# Altium schematic sheet Power.SchDoc: F4 Flight Controller
size 500 x 299 mm; Engineer: İlker Keser; SheetNumber: 2; SheetTotal: 6
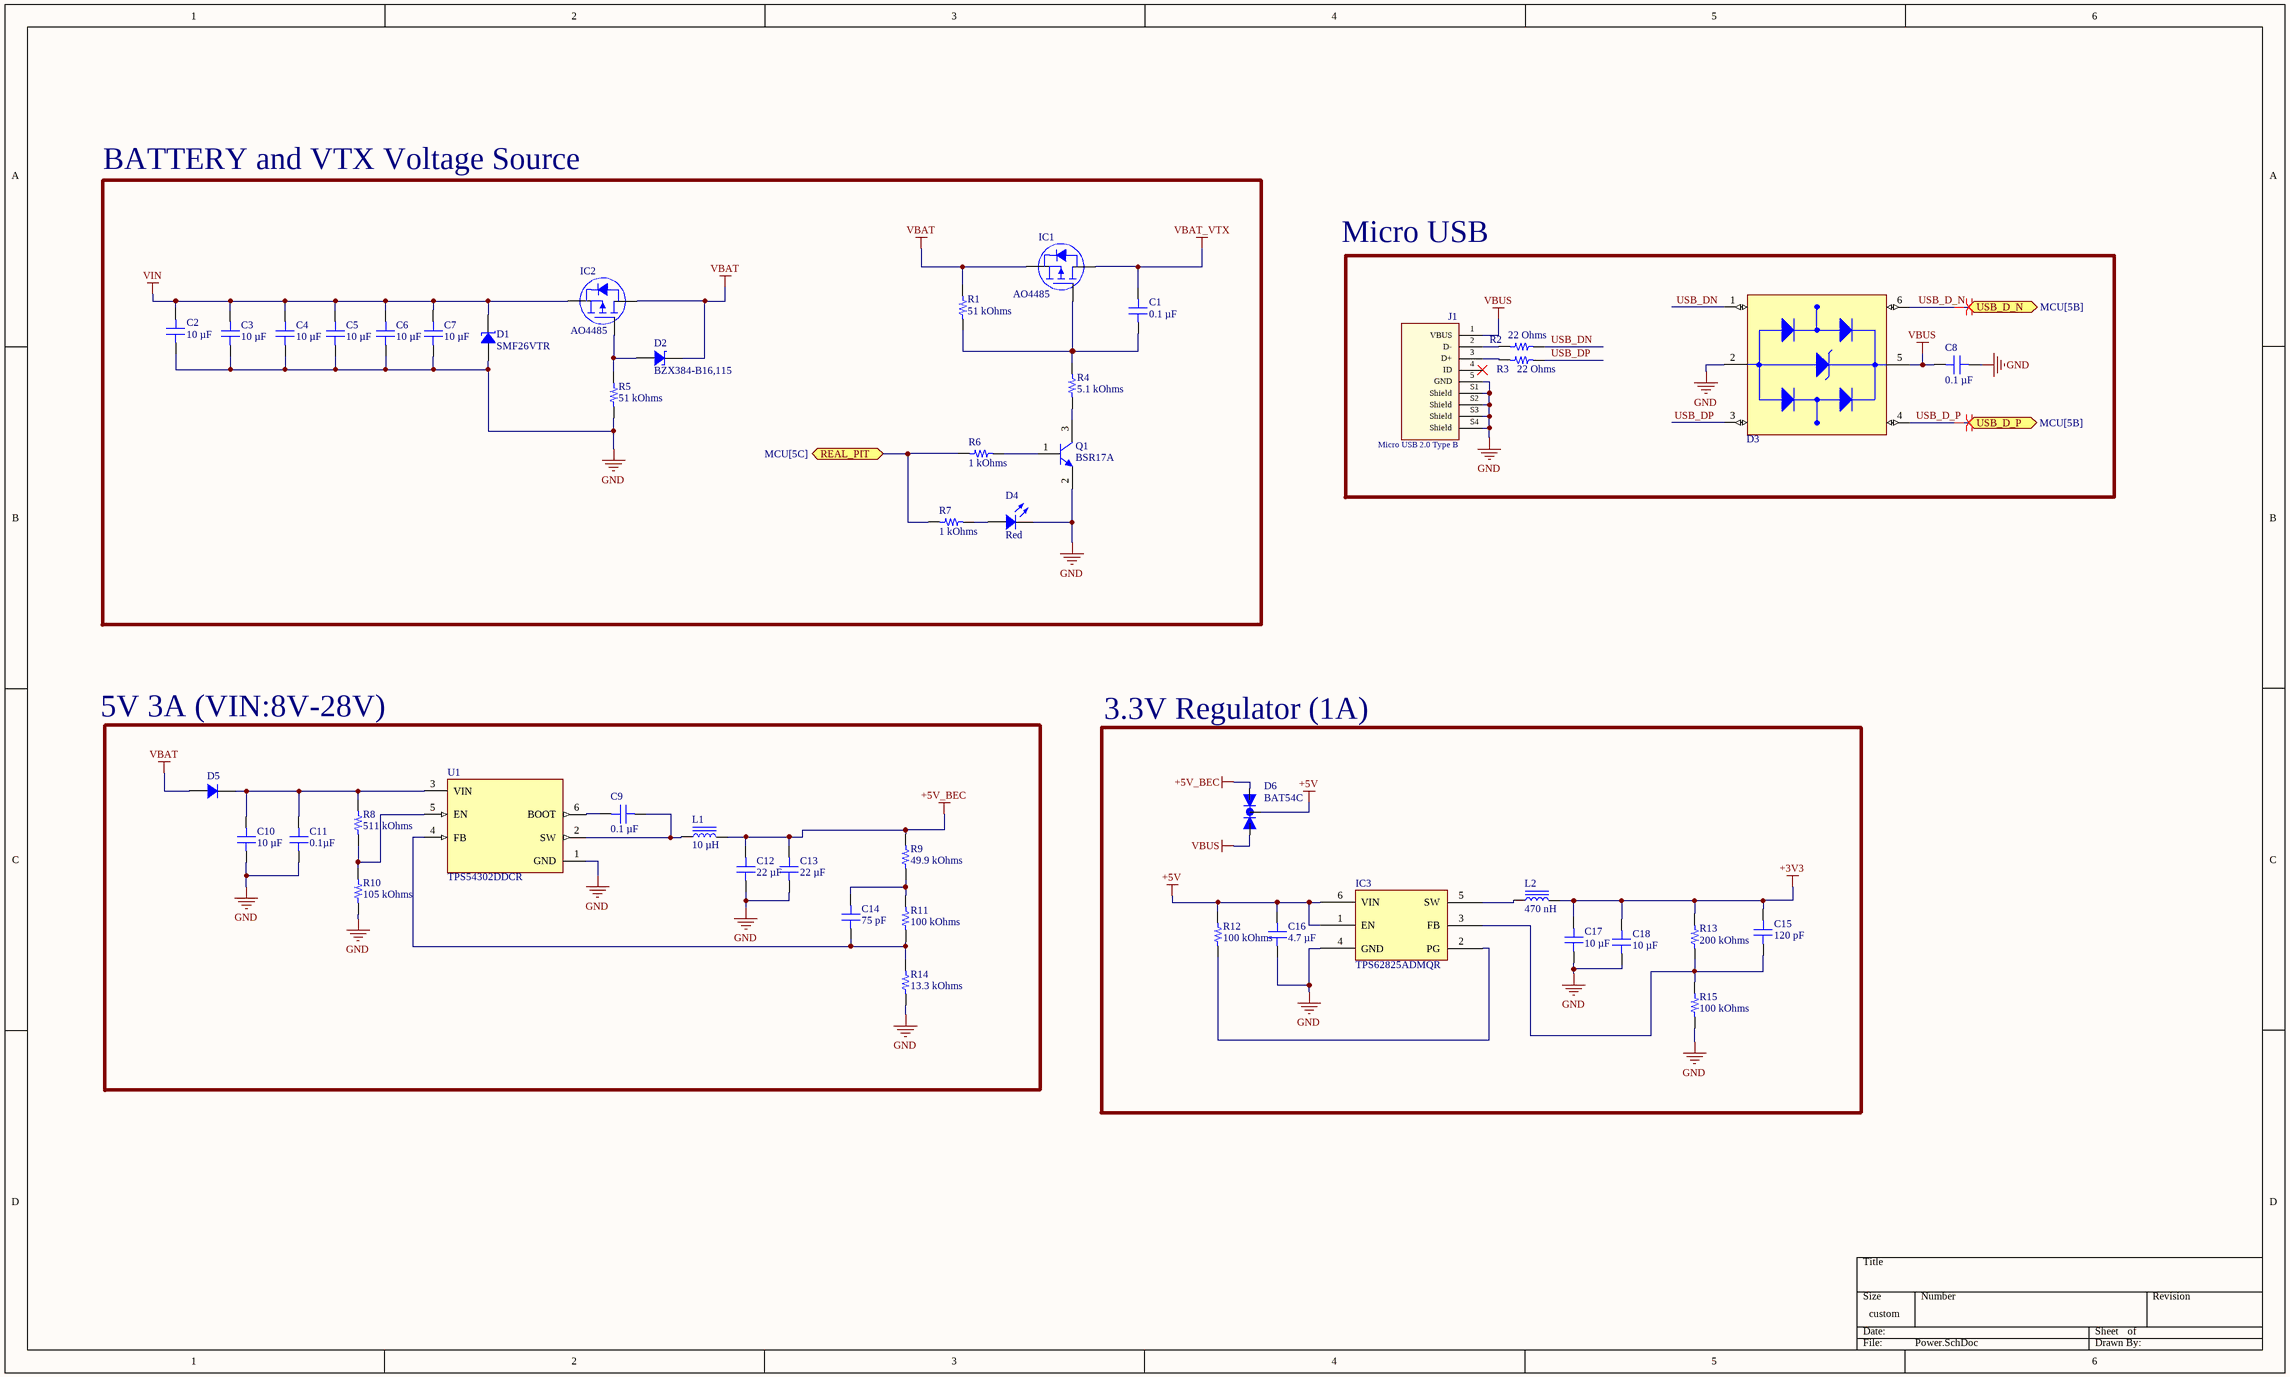
[diagram p0: Power.SchDoc]

## Parts
C1  0.1 µF  [CAP 0603_1608]
C2  10 µF  [MURATA CAP GRM31C 1206_3216]
C3  10 µF  [MURATA CAP GRM31C 1206_3216]
C4  10 µF  [MURATA CAP GRM31C 1206_3216]
C5  10 µF  [MURATA CAP GRM31C 1206_3216]
C6  10 µF  [MURATA CAP GRM31C 1206_3216]
C7  10 µF  [MURATA CAP GRM31C 1206_3216]
C8  0.1 µF  [CAP 0402_1005]
C9  0.1 µF  [CAP 0402_1005]
C10  10 µF  [MURATA CAP GRM31C 1206_3216]
C11  0.1µF  [CAP 0603_1608]
C12  22 µF  [CAP 0402_1005]
C13  22 µF  [CAP 0402_1005]
C14  75 pF  [CAP 0603_1608]
C15  120 pF  [CAP 0402_1005]
C16  4.7 µF  [CAP 0603_1608]
C17  10 µF  [MURATA GRM188 0603_1608]
C18  10 µF  [MURATA GRM188 0603_1608]
D1  SMF26VTR  [SOD123F]
D2  BZX384-B16,115  [SOD323]
D3  USBLC6-2SC6  [SOT23-6L]  (value not drawn)
D4  Red  [LED 0603_1608 RED]
D5  PMEG1030EH,115  [SOD123F]  (value not drawn)
D6  BAT54C  [BAT54C]
IC1  AO4485  [ALPHAOMEGA SO8 SOP-8L AO4485]
IC2  AO4485  [ALPHAOMEGA SO8 SOP-8L AO4485]
IC3  TPS62825ADMQR  [TI - VSON-6 DMQ0006A]
J1  Micro USB 2.0 Type B  [629105136821]
L1  10 µH  [WURTH WE-HCI 7050]
L2  470 nH  [IND 0806_2016]
Q1  BSR17A  [ON SEMI SOT-23-3]
R1  51 kOhms  [YAGEO RES 0402_1005]
R2  22 Ohms  [YAGEO RES 0402_1005]
R3  22 Ohms  [YAGEO RES 0402_1005]
R4  5.1 kOhms  [YAGEO RES 0402_1005]
R5  51 kOhms  [YAGEO RES 0402_1005]
R6  1 kOhms  [YAGEO RES 0402_1005]
R7  1 kOhms  [YAGEO RES 0402_1005]
R8  511 kOhms  [YAGEO RES 0402_1005]
R9  49.9 kOhms  [YAGEO RES 0201_0603]
R10  105 kOhms  [YAGEO RES 0402_1005]
R11  100 kOhms  [YAGEO RES 0402_1005]
R12  100 kOhms  [YAGEO RES 0402_1005]
R13  200 kOhms  [YAGEO RES 0402_1005]
R14  13.3 kOhms  [YAGEO RES 0402_1005]
R15  100 kOhms  [YAGEO RES 0402_1005]
U1  TPS54302DDCR  [TPS54302DDCR]

## Blocks framed on the sheet
BATTERY and VTX Voltage Source: C1-C7 D1 D2 D4 IC1 IC2 Q1 R1 R4-R7
3.3V Regulator (1A): C15-C18 D6 IC3 L2 R12 R13 R15

## Ports
REAL_PIT (bidir, see MCU[5C]), USB_D_N (bidir, see MCU[5B]), USB_D_P (bidir, see MCU[5B])

## Nets
+3V3: C15.2 C17.2 C18.2 L2.2 R13.2
+5V: C16.2 D6.3(C) IC3.1(EN) IC3.6(VIN) R12.2
+5V_BEC: C12.2 C13.2 D6.1(A1) L1.2 R9.2
GND: C2.1 C3.1 C4.1 C5.1 C6.1 C7.1 C8.1 C10.1 C11.1 C12.1 C13.1 C16.1 C17.1 C18.1 D1.1 D3.2(GND) D4.2 IC3.4(GND) J1.5(GND) J1.S1(Shield) J1.S2(Shield) J1.S3(Shield) J1.S4(Shield) Q1.2(E) R5.1 R10.1 R14.1 R15.1 U1.1(GND)
VBAT: D2.2 D5.1 IC1.S IC2.D R1.2
VBAT_VTX: C1.2 IC1.D
VBUS: C8.2 D3.5(VBUS) D6.2(A2) J1.1(VBUS)
VIN: C2.2 C3.2 C4.2 C5.2 C6.2 C7.2 D1.2 IC2.S
REAL_PIT: R6.1 R7.1 ; port REAL_PIT
USB_D_N: D3.6(I/O1_OUT) ; port USB_D_N
USB_D_P: D3.4(I/O2_OUT) ; port USB_D_P
USB_DN: D3.1(I/O1_IN) R2.2
USB_DP: D3.3(I/O2_IN) R3.2
NetC1_1: C1.1 IC1.G R1.1 R4.2
NetC9_1: C9.1 U1.6(BOOT)
NetC9_2: C9.2 L1.1 U1.2(SW)
NetC10_2: C10.2 C11.2 D5.2 R8.1 U1.3(VIN)
NetC14_1: C14.1 R11.1 R14.2 U1.4(FB)
NetC14_2: C14.2 R9.1 R11.2
NetC15_1: C15.1 IC3.3(FB) R13.1 R15.2
NetD2_1: D2.1 IC2.G R5.2
NetD4_1: D4.1 R7.2
NetIC3_2: IC3.2(PG) R12.1
NetIC3_5: IC3.5(SW) L2.1
NetJ1_2: J1.2(D-) R2.1
NetJ1_3: J1.3(D+) R3.1
NetQ1_1: Q1.1(B) R6.2
NetQ1_3: Q1.3(C) R4.1
NetR8_2: R8.2 R10.2 U1.5(EN)

Not connected (* = marked no-connect by the designer): J1 4(ID)*

## Layout directives
differential pair; differential pair class USB: USB_D_N, USB_D_P

## Notes on the sheet
- Micro USB
- 5V 3A (VIN:8V-28V)

## Library data of the parts
C1 = CL10B104KB8NNNC: CAP CER 0.1UF 50V X7R 0603; manufacturer: Samsung Electro-Mechanics; Tolerance: ±10%; Part Number: CL10B104KB8NNNC; Capacitance: 0.1 µF; Applications: General Purpose; componentlink1description: Datasheet; componentlink1url: http://www.samsungsem.com/kr/support/product-search/mlcc/CL10B104KB8NNNC.jsp; componentlink2description: DigiKey Link; componentlink2url: https://www.digikey.com/en/products/detail/samsung-electro-mechanics/CL10B104KB8NNNC/3886658; Device Package: 0603 (1608 Metric); lastupdated: 9.02.2024 20:10:20; Lifecycle Status: Active; Minimum Order: 1; Mounting Type: Surface Mount, MLCC; Operating Temperature: -55°C ~ 125°C; Package / Case: 0603 (1608 Metric); packaging: TapeAndReel; partid: 9788; Part Status: Active; price: 0.01; series: CL; Size / Dimension: 0.063" L x 0.031" W (1.60mm x 0.80mm); Supplier 1: DigiKey; Supplier Part Number 1: 1276-1000-1-ND; Temperature Coefficient: X7R; Thickness (Max): 0.035" (0.90mm); value: 0.1 µF; Voltage - Rated: 50V
C2-C7 C10 = GRM31CD71H106KE11L: CAP CER 10UF 50V X7T 1206; manufacturer: Murata Electronics; Tolerance: ±10%; Part Number: GRM31CD71H106KE11L; Capacitance: 10 µF; Applications: General Purpose; componentlink1description: Datasheet; componentlink1url: https://search.murata.co.jp/Ceramy/image/img/A01X/G101/ENG/GRM31CD71H106KE11-01A.pdf; componentlink2description: DigiKey Link; componentlink2url: https://www.digikey.com/en/products/detail/murata-electronics/GRM31CD71H106KE11L/13401866; Device Package: 1206 (3216 Metric); lastupdated: 6.09.2024 02:27:22; Lifecycle Status: Active; Minimum Order: 1; Mounting Type: Surface Mount, MLCC; Operating Temperature: -55°C ~ 125°C; Package / Case: 1206 (3216 Metric); packaging: TapeAndReel; partid: 39885; Part Status: Active; price: 0.25; series: GRM; Size / Dimension: 0.126" L x 0.063" W (3.20mm x 1.60mm); Supplier 1: DigiKey; Supplier Part Number 1: 490-GRM31CD71H106KE11LCT-ND; Temperature Coefficient: X7T; Thickness (Max): 0.071" (1.80mm); value: 10 µF; Voltage - Rated: 50V
C8 = CC0402MRX5R5BB104: CAP CER 0.1UF 6.3V X5R 0402; manufacturer: Yageo; Tolerance: ±20%; Part Number: CC0402MRX5R5BB104; Capacitance: 0.1 µF; Applications: General Purpose; componentlink1description: Datasheet; componentlink1url: https://www.yageo.com/upload/media/product/productsearch/datasheet/mlcc/UPY-GPHC_X5R_4V-to-50V_25.pdf; componentlink2description: DigiKey Link; componentlink2url: https://www.digikey.com/en/products/detail/yageo/CC0402MRX5R5BB104/5883384; Device Package: 0402 (1005 Metric); lastupdated: 9.02.2024 20:04:37; Lifecycle Status: Active; Minimum Order: 10; Mounting Type: Surface Mount, MLCC; Operating Temperature: -55°C ~ 85°C; Package / Case: 0402 (1005 Metric); packaging: CutTape; partid: 1960; Part Status: Active; price: 0.01; series: CC; Size / Dimension: 0.039" L x 0.020" W (1.00mm x 0.50mm); Supplier 1: DigiKey; Supplier Part Number 1: 311-3818-1-ND; Temperature Coefficient: X5R; Thickness (Max): 0.022" (0.55mm); value: 0.1 µF; Voltage - Rated: 6.3V
C9 = 0402B104M500CT: CAP CER 0.1UF 50V X7R 0402; manufacturer: Walsin Technology Corporation; Tolerance: ±20%; Part Number: 0402B104M500CT; Capacitance: 0.1 µF; Applications: General Purpose; componentlink1description: Datasheet; componentlink1url: http://www.passivecomponent.com/wp-content/uploads/2018/10/MLCC.pdf; componentlink2description: DigiKey Link; componentlink2url: https://www.digikey.com/en/products/detail/walsin-technology-corporation/0402B104M500CT/9354677; Device Package: 0402 (1005 Metric); lastupdated: 9.02.2024 20:04:28; Lifecycle Status: Active; Minimum Order: 1; Mounting Type: Surface Mount, MLCC; Operating Temperature: -55°C ~ 125°C; Package / Case: 0402 (1005 Metric); packaging: TapeAndReel; partid: 7712; Part Status: Active; price: 0.01; series: -; Size / Dimension: 0.039" L x 0.020" W (1.00mm x 0.50mm); Supplier 1: DigiKey; Supplier Part Number 1: 1292-1179-1-ND; Temperature Coefficient: X7R; Thickness (Max): 0.028" (0.70mm); value: 0.1 µF; Voltage - Rated: 50V
C11 = 06035C104JAT2A: CAP CER 0.1UF 50V X7R 0603; manufacturer: AVX Corporation; Tolerance: ±5%; Part Number: 06035C104JAT2A; Capacitance: 0.1µF; Applications: General Purpose; componentlink1description: Datasheet; componentlink1url: http://datasheets.avx.com/X7RDielectric.pdf; componentlink2description: DigiKey Link; componentlink2url: http://digikey.com/product-detail/en/avx-corporation/06035C104JAT2A/478-5778-1-ND/2136370; Device Package: 0603 (1608 Metric); lastupdated: 2.09.2020 01:03:14; Lifecycle Status: Active; Minimum Order: 1; Mounting Type: Surface Mount, MLCC; Operating Temperature: -55°C ~ 125°C; Package / Case: 0603 (1608 Metric); packaging: TapeAndReel; partid: 14115; Part Status: Active; price: 0.01; series: -; Size / Dimension: 0.063" L x 0.032" W (1.60mm x 0.81mm); Supplier 1: DigiKey; Supplier Part Number 1: 478-5778-1-ND; Temperature Coefficient: X7R; Thickness (Max): 0.035" (0.90mm); value: 0.1µF; Voltage - Rated: 50V
C12 C13 = GRM158R61A226ME15D: CAP CER 22UF 10V X5R 0402; manufacturer: Murata Electronics; Tolerance: ±20%; Part Number: GRM158R61A226ME15D; Capacitance: 22 µF; Applications: General Purpose; componentlink1description: Datasheet; componentlink1url: https://search.murata.co.jp/Ceramy/image/img/A01X/G101/ENG/GRM158R61A226ME15-01A.pdf; componentlink2description: DigiKey Link; componentlink2url: https://www.digikey.com/en/products/detail/murata-electronics/GRM158R61A226ME15D/16033379; Device Package: 0402 (1005 Metric); lastupdated: 9.02.2024 20:04:08; Lifecycle Status: Active; Minimum Order: 1; Mounting Type: Surface Mount, MLCC; Operating Temperature: -55°C ~ 85°C; Package / Case: 0402 (1005 Metric); packaging: TapeAndReel; partid: 44973; Part Status: Active; price: 0.08; series: GRM; Size / Dimension: 0.039" L x 0.020" W (1.00mm x 0.50mm); Supplier 1: DigiKey; Supplier Part Number 1: 490-GRM158R61A226ME15DCT-ND; Temperature Coefficient: X5R; Thickness (Max): 0.031" (0.80mm); value: 22 µF; Voltage - Rated: 10V
C14 = CBR06C750F5GAC: CAP CER 75PF 50V C0G/NP0 0603; manufacturer: KEMET; Temperature Coefficient: C0G, NP0; Tolerance: ±1%; Part Number: CBR06C750F5GAC; Capacitance: 75 pF; Applications: RF, Microwave, High Frequency; componentlink1description: Datasheet; componentlink1url: https://api.kemet.com/component-edge/download/datasheet/CBR06C750F5GAC.pdf; componentlink2description: DigiKey Link; componentlink2url: https://www.digikey.com/en/products/detail/kemet/CBR06C750F5GAC/7649551; Device Package: 0603 (1608 Metric); Features: High Q, Low Loss, Ultra Low ESR; lastupdated: 9.02.2024 20:10:25; Lifecycle Status: Active; Minimum Order: 1; Mounting Type: Surface Mount, MLCC; Operating Temperature: -55°C ~ 125°C; Package / Case: 0603 (1608 Metric); packaging: TapeAndReel; partid: 6470; Part Status: Active; price: 0.28; series: CBR-SMD RF C0G; Size / Dimension: 0.063" L x 0.031" W (1.60mm x 0.80mm); Supplier 1: DigiKey; Supplier Part Number 1: 399-16245-1-ND; Thickness (Max): 0.035" (0.90mm); value: 75 pF; Voltage - Rated: 50V
C15 = C0402C121J5GACAUTO: CAP CER 120PF 50V C0G/NP0 0402; manufacturer: KEMET; Temperature Coefficient: C0G, NP0; Tolerance: ±5%; Part Number: C0402C121J5GACAUTO; Capacitance: 120 pF; Applications: Automotive; componentlink1description: Datasheet; componentlink1url: https://api.kemet.com/component-edge/download/datasheet/C0402C121J5GACAUTO.pdf; componentlink2description: DigiKey Link; componentlink2url: https://www.digikey.com/en/products/detail/kemet/C0402C121J5GACAUTO/7516020; Device Package: 0402 (1005 Metric); Features: Low ESL; lastupdated: 9.02.2024 20:04:27; Lifecycle Status: Active; Minimum Order: 1; Mounting Type: Surface Mount, MLCC; Operating Temperature: -55°C ~ 125°C; Package / Case: 0402 (1005 Metric); packaging: TapeAndReel; partid: 8372; Part Status: Active; price: 0.01; Ratings: AEC-Q200; series: SMD Auto C0G; Size / Dimension: 0.039" L x 0.020" W (1.00mm x 0.50mm); Supplier 1: DigiKey; Supplier Part Number 1: 399-15786-1-ND; Thickness (Max): 0.022" (0.55mm); value: 120 pF; Voltage - Rated: 50V
C16 = JMK107BJ475MK-T: CAP CER 4.7UF 6.3V X5R 0603; manufacturer: Taiyo Yuden; Tolerance: ±20%; Part Number: JMK107BJ475MK-T; Capacitance: 4.7 µF; Applications: SMPS Filtering; componentlink1description: Datasheet; componentlink1url: https://www.yuden.co.jp/productdata/catalog/mlcc01_e.pdf; componentlink2description: DigiKey Link; componentlink2url: https://www.digikey.com/en/products/detail/taiyo-yuden/JMK107BJ475MK-T/1219296; Device Package: 0603 (1608 Metric); lastupdated: 9.02.2024 20:10:18; Lifecycle Status: Active; Minimum Order: 1; Mounting Type: Surface Mount, MLCC; Operating Temperature: -55°C ~ 85°C; Package / Case: 0603 (1608 Metric); packaging: TapeAndReel; partid: 11779; Part Status: Active; price: 0.04; series: M; Size / Dimension: 0.063" L x 0.031" W (1.60mm x 0.80mm); Supplier 1: DigiKey; Supplier Part Number 1: 587-1944-1-ND; Temperature Coefficient: X5R; Thickness (Max): 0.020" (0.50mm); value: 4.7 µF; Voltage - Rated: 6.3V
C17 C18 = GRM188Z71A106KA73D: CAP CER 10UF 10V X7R 0603; manufacturer: Murata Electronics; Tolerance: ±10%; Part Number: GRM188Z71A106KA73D; Capacitance: 10 µF; Applications: General Purpose; componentlink1description: Datasheet; componentlink1url: https://search.murata.co.jp/Ceramy/image/img/A01X/G101/ENG/GRM188Z71A106KA73-01A.pdf; componentlink2description: DigiKey Link; componentlink2url: https://www.digikey.com/en/products/detail/murata-electronics/GRM188Z71A106KA73D/13401725; Device Package: 0603 (1608 Metric); lastupdated: 20.07.2024 00:23:19; Lifecycle Status: Active; Minimum Order: 1; Mounting Type: Surface Mount, MLCC; Operating Temperature: -55°C ~ 125°C; Package / Case: 0603 (1608 Metric); packaging: TapeAndReel; partid: 44714; Part Status: Active; price: 0.06; series: GRM; Size / Dimension: 0.063" L x 0.031" W (1.60mm x 0.80mm); Supplier 1: DigiKey; Supplier Part Number 1: 490-GRM188Z71A106KA73DCT-ND; Temperature Coefficient: X7R; Thickness (Max): 0.039" (1.00mm); value: 10 µF; Voltage - Rated: 10V
D1 = SMF26VTR: TVS DIODE 26VWM 42.1VC PMDU; Manufacturer: Rohm Semiconductor; Current - Peak Pulse (10/1000µs): 4.8A; Power Line Protection: No; Power - Peak Pulse: 200W; Type: Zener; Unidirectional Channels: 1; Voltage - Breakdown (Min): 28.9V; Voltage - Clamping (Max) @ Ipp: 42.1V; Voltage - Reverse Standoff (Typ): 26V (Max); Part Number: SMF26VTR; Applications: General Purpose; ComponentLink1Description: Datasheet; ComponentLink1URL: https://www.rohm.com/datasheet/SMF5V0/smf5v0tr-e; ComponentLink2Description: DigiKey Link; ComponentLink2URL: https://www.digikey.com/en/products/detail/rohm-semiconductor/SMF26VTR/10709441; LastUpdated: 3.06.2024 20:22:36; Lifecycle Status: Active; Minimum Order: 1; Mounting Type: Surface Mount; Operating Temperature: 150°C (TJ); Package / Case: SOD-123F; Packaging: TapeAndReel; PartId: 10063; Part Status: Active; Price: 0.09; Series: -; Supplier 1: DigiKey; Supplier Part Number 1: 846-SMF26VCT-ND; Supplier Device Package: PMDU
D2 = BZX384-B16,115: DIODE ZENER 16V 300MW SOD323; Manufacturer: Nexperia USA Inc.; Current - Reverse Leakage @ Vr: 50 nA @ 11.2 V; Impedance (Max) (Zzt): 40 Ohms; Tolerance: ±2%; Voltage - Forward (Vf) (Max) @ If: 1.1 V @ 100 mA; Part Number: BZX384-B16,115; ComponentLink1Description: Datasheet; ComponentLink1URL: https://assets.nexperia.com/documents/data-sheet/BZX384_SERIES.pdf; ComponentLink2Description: DigiKey Link; ComponentLink2URL: https://www.digikey.com/en/products/detail/nexperia-usa-inc/BZX384-B16-115/1162899; LastUpdated: 3.06.2024 20:20:30; Lifecycle Status: Active; Minimum Order: 1; Mounting Type: Surface Mount; Operating Temperature: -65°C ~ 150°C; Package / Case: SC-76, SOD-323; Packaging: TapeAndReel; PartId: 3814; Part Status: Active; Power - Max: 300 mW; Price: 0.02; Series: BZX384; Supplier 1: DigiKey; Supplier Part Number 1: 1727-3641-1-ND; Supplier Device Package: SOD-323; Voltage - Zener (Nom) (Vz): 16 V
D3 = USBLC6-2SC6: 15V Clamp 6A (8/20µs) Ipp Tvs Diode Surface Mount SOT-23-6; Designed by: İK; Voltage - Reverse Standoff (Typ): 5.25V; Voltage - Breakdown (Min): 6V; Voltage - Clamping (Max) @ Ipp: 17V; Current - Peak Pulse (10/1000µs): 5A (8/20µs); Operating Temperature: -40°C ~ 150°C (TJ); Package / Case: SOT23-6; ComponentLink1Description: Datasheet; ComponentLink1URL: https://mm.digikey.com/Volume0/opasdata/d220001/medias/docus/5338/USBLC6-2SC6.pdf; ComponentLink2Description: Digikey Link; ComponentLink2URL: https://www.digikey.com/en/products/detail/umw/usblc6-2sc6/16705896
D4 = B18W1USD-20C000214U1930: LED RED 0603 SMD; Manufacturer: Harvatek Corporation; Lens Size: 0.80mm Dia; Lens Style: Round with Domed Top; Millicandela Rating: 750mcd; Viewing Angle: 55°; Voltage - Forward (Vf) (Typ): 2V; Wavelength - Dominant: 622nm; Wavelength - Peak: 630nm; Part Number: B18W1USD-20C000214U1930; Color: Red; ComponentLink1Description: Datasheet; ComponentLink1URL: https://media.digikey.com/pdf/Data%20Sheets/Harvatek%20PDFs/B18W1USD-20C000214U1930%20%20V1.2.pdf; ComponentLink2Description: DigiKey Link; ComponentLink2URL: https://www.digikey.com/en/products/detail/harvatek-corporation/B18W1USD-20C000214U1930/13588738; Device Package: 0603 (1608 Metric); Height (Max): 1.05mm; LastUpdated: 3.06.2024 19:59:46; Lifecycle Status: Active; Minimum Order: 1; Mounting Type: Surface Mount; Package / Case: 0603 (1608 Metric); Packaging: TapeAndReel; PartId: 1019; Part Status: Active; Price: 0.14; Series: -; Size / Dimension: 1.60mm L x 0.80mm W; Supplier 1: DigiKey; Supplier Part Number 1: 3147-B18W1USD-20C000214U1930CT-ND; Supplier Device Package: 0603; Value: Red
D5 = PMEG1030EH,115: DIODE SCHOTTKY 10V 3A SOD123F; Manufacturer: Nexperia USA Inc.; Capacitance @ Vr, F: 85pF @ 1V, 1MHz; Current - Reverse Leakage @ Vr: 3 mA @ 10 V; Speed: Fast Recovery =< 500ns, > 200mA (Io); Voltage - Forward (Vf) (Max) @ If: 530 mV @ 3 A; Part Number: PMEG1030EH,115; ComponentLink1Description: Datasheet; ComponentLink1URL: https://assets.nexperia.com/documents/data-sheet/PMEG1030EH_EJ.pdf; ComponentLink2Description: DigiKey Link; ComponentLink2URL: https://www.digikey.com/en/products/detail/nexperia-usa-inc/PMEG1030EH-115/1157659; Current - Average Rectified (Io): 3A; Diode Type: Schottky; LastUpdated: 3.06.2024 19:54:57; Lifecycle Status: Active; Minimum Order: 1; Mounting Type: Surface Mount; Operating Temperature - Junction: 150°C (Max); Package / Case: SOD-123F; Packaging: TapeAndReel; PartId: 2419; Part Status: Active; Price: 0.07; Series: -; Supplier 1: DigiKey; Supplier Part Number 1: 1727-3851-1-ND; Supplier Device Package: SOD-123F; Voltage - DC Reverse (Vr) (Max): 10 V
D6 = BAT54C: Diode Array 1 Pair Common Cathode 30 V 200mA Surface Mount TO-236-3, SC-59, SOT-23-3; Voltage - DC Reverse (Vr) (Max): 30V; Speed: Small Signal =< 200mA (Io), Any Speed; Voltage - Forward (Vf) (Max) @ If: 800 mV @ 100 mA; Reverse Recovery Time (trr): 5ns; Current - Reverse Leakage @ Vr: 2 µA @ 25 V; Current - Average Rectified (Io) (per Diode): 200mA; Operating Temperature - Junction: -55°C ~ 150°C; Package / Case: TO-236-3, SC-59, SOT-23-3; ComponentLink1Description: Digikey Link; ComponentLink1URL: https://www.digikey.com/en/products/detail/onsemi/bat54c/458826; ComponentLink2Description: Datasheet; ComponentLink2URL: https://mm.digikey.com/Volume0/opasdata/d220001/medias/docus/569/BAT54%28A%2CC%2CS%29.pdf
IC1 IC2 = AO4485: MOSFET P-CH 40V 10A 8SOIC; Manufacturer: Alpha & Omega Semiconductor Inc.; Current - Continuous Drain (Id) @ 25°C: 10A (Ta); Drive Voltage (Max Rds On,  Min Rds On): 4.5V, 10V; FET Type: P-Channel; Gate Charge (Qg) (Max) @ Vgs: 55 nC @ 10 V; Input Capacitance (Ciss) (Max) @ Vds: 3000 pF @ 20 V; Power Dissipation (Max): 1.7W (Ta); Rds On (Max) @ Id, Vgs: 15mOhm @ 10A, 10V; Vgs (Max): ±20V; Vgs(th) (Max) @ Id: 2.5V @ 250µA; Part Number: AO4485; ComponentLink1Description: Datasheet; ComponentLink1URL: http://aosmd.com/res/data_sheets/AO4485.pdf; ComponentLink2Description: DigiKey Link; ComponentLink2URL: https://www.digikey.com/en/products/detail/alpha-omega-semiconductor-inc/AO4485/3152385; Drain to Source Voltage (Vdss): 40 V; LastUpdated: 25.09.2022 04:45:44; Lifecycle Status: Active; Minimum Order: 1; Mounting Type: Surface Mount; Operating Temperature: -55°C ~ 150°C (TJ); Package / Case: 8-SOIC (0.154", 3.90mm Width); Packaging: TapeAndReel; Part Status: Active; Price: 0.35; Series: -; Supplier 1: DigiKey; Supplier Part Number 1: 785-1551-1-ND; Supplier Device Package: 8-SOIC; Technology: MOSFET (Metal Oxide)
IC3 = TPS62825ADMQR: IC REG BUCK ADJ 2A 6VSON; Manufacturer: Texas Instruments; Frequency - Switching: 2.2MHz; Function: Step-Down; Number of Outputs: 1; Output Configuration: Positive; Output Type: Adjustable; Synchronous Rectifier: Yes; Voltage - Input (Max): 5.5V; Voltage - Input (Min): 2.4V; Voltage - Output (Max): 4V; Voltage - Output (Min/Fixed): 0.6V; Part Number: TPS62825ADMQR; ComponentLink2Description: DigiKey Link; ComponentLink2URL: https://www.digikey.com/en/products/detail/texas-instruments/TPS62825ADMQR/13627220; Current - Output: 2A; LastUpdated: 1.11.2024 12:01:51; Lifecycle Status: Active; Minimum Order: 1; Mounting Type: Surface Mount; Operating Temperature: -40°C ~ 125°C (TJ); Packaging: TapeAndReel; Part Status: Active; Price: 0.44; Series: -; Supplier 1: DigiKey; Supplier Part Number 1: 296-TPS62825ADMQRCT-ND; Supplier Device Package: 6-VSON-HR (1.5x1.5); Topology: Buck
J1 = 629105136821: Micro USB 2.0 Type B Horizontal SMT 5 Contacts WR-COM; Rated Current: 1 A; Gender: Female; ComponentLink1Description: Manufacturer; ComponentLink1URL: http://www.we-online.de; ComponentLink2Description: Datasheet; ComponentLink2URL: http://katalog.we-online.de/em/datasheet/629105136821.pdf; Part Number: 629105136821; Published Date: May 2018; Publisher: Wurth Elektronik; Orientation: Horizontal; Interface Type: Micro USB 2.0 Type B; Operating Temperature: -40 to 85 degC; Mounting Technology: SMT; Packaging: Tape and Reel
L1 = 744314101: FIXED IND 10UH 3.5A 33 MOHM SMD; Manufacturer: Würth Elektronik; Current - Saturation: 4A; DC Resistance (DCR): 33mOhm; Frequency - Self Resonant: 40MHz; Inductance Frequency - Test: 100 kHz; Material - Core: Nonstandard; Shielding: Shielded; Tolerance: ±20%; Type: Wirewound; Part Number: 744314101; ComponentLink1Description: Datasheet; ComponentLink1URL: https://katalog.we-online.de/pbs/datasheet/744314101.pdf; ComponentLink2Description: DigiKey Link; ComponentLink2URL: https://www.digikey.com/en/products/detail/würth-elektronik/744314101/2175596; Current Rating (Amps): 3.5 A; Device Package: Nonstandard; Height - Seated (Max): 0.197" (5.00mm); Inductance: 10 µH; LastUpdated: 3.06.2024 20:02:49; Lifecycle Status: Active; Minimum Order: 1; Mounting Type: Surface Mount; Operating Temperature: -40°C ~ 150°C; Package / Case: Nonstandard; Packaging: TapeAndReel; PartId: 271; Part Status: Active; Price: 2.72; Ratings: AEC-Q200; Series: WE-HCI; Size / Dimension: 0.276" L x 0.272" W (7.00mm x 6.90mm); Supplier 1: DigiKey; Supplier Part Number 1: 732-2180-1-ND; Supplier Device Package: 7050; Value: 10 µH
L2 = TFM201610ALC-R47MTAA: FIXED IND 470NH 5.2A 25 MOHM SMD; Manufacturer: TDK Corporation; Current - Saturation: 5.1A; DC Resistance (DCR): 25mOhm Max; Inductance Frequency - Test: 1 MHz; Material - Core: Metal; Shielding: Shielded; Tolerance: ±20%; Type: Thin Film; Part Number: TFM201610ALC-R47MTAA; ComponentLink1Description: Datasheet; ComponentLink1URL: https://product.tdk.com/info/en/catalog/datasheets/inductor_commercial_power_tfm201610alc_en.pdf?ref_disty=digikey; ComponentLink2Description: DigiKey Link; ComponentLink2URL: https://www.digikey.com/en/products/detail/tdk-corporation/TFM201610ALC-R47MTAA/9169841; Current Rating (Amps): 5.2 A; Device Package: 0806 (2016 Metric); Height - Seated (Max): 0.039" (1.00mm); Inductance: 470 nH; LastUpdated: 3.06.2024 20:14:10; Lifecycle Status: Active; Minimum Order: 1; Mounting Type: Surface Mount; Operating Temperature: -40°C ~ 125°C; Package / Case: 0806 (2016 Metric); Packaging: TapeAndReel; PartId: 3225; Part Status: Active; Price: 0.24; Series: TFM-ALC; Size / Dimension: 0.079" L x 0.063" W (2.00mm x 1.60mm); Supplier 1: DigiKey; Supplier Part Number 1: 445-180258-1-ND; Supplier Device Package: 0806 (2016 Metric); Value: 470 nH
Q1 = BSR17A: TRANS NPN 40V 0.2A SOT-23; Manufacturer: ON Semiconductor; Current - Collector Cutoff (Max): 5µA (ICBO); Current - Collector (Ic) (Max): 200mA; DC Current Gain (hFE) (Min) @ Ic, Vce: 100 @ 10mA, 1V; Frequency - Transition: 300MHz; Power - Max: 350mW; Vce Saturation (Max) @ Ib, Ic: 300mV @ 5mA, 50mA; Part Number: BSR17A; ComponentLink1Description: Datasheet; ComponentLink1URL: https://www.onsemi.com/pub/Collateral/BSR17A-D.pdf; ComponentLink2Description: DigiKey Link; ComponentLink2URL: http://digikey.com/product-detail/en/on-semiconductor/BSR17A/BSR17ACT-ND/2094410; LastUpdated: 3.06.2024 20:24:14; Lifecycle Status: Active; Minimum Order: 1; Mounting Type: Surface Mount; Operating Temperature: -55°C ~ 150°C (TJ); Package / Case: TO-236-3, SC-59, SOT-23-3; Packaging: TapeAndReel; PartId: 207; Part Status: Active; Price: 0.05; Series: -; Supplier 1: DigiKey; Supplier Part Number 1: BSR17ACT-ND; Supplier Device Package: SOT-23-3; Transistor Type: NPN; Voltage - Collector Emitter Breakdown (Max): 40V
R1 R5 = RC0402JR-0751KL: RES 51K OHM 5% 1/16W 0402; Manufacturer: Yageo; Power (Watts): 0.063W, 1/16W; Temperature Coefficient: ±100ppm/°C; Part Number: RC0402JR-0751KL; Value: 51 kOhms; ComponentLink1Description: Datasheet; ComponentLink1URL: https://www.yageo.com/upload/media/product/productsearch/datasheet/rchip/PYu-RC_Group_51_RoHS_L_10.pdf; ComponentLink2Description: DigiKey Link; ComponentLink2URL: https://www.digikey.com/en/products/detail/yageo/RC0402JR-0751KL/2827651; Composition: Thick Film; Device Package: 0402 (1005 Metric); Features: Moisture Resistant; Height - Seated (Max): 0.016" (0.40mm); LastUpdated: 25.07.2024 09:18:16; Lifecycle Status: Active; Minimum Order: 1; Number of Terminations: 2; Operating Temperature: -55°C ~ 155°C; Package / Case: 0402 (1005 Metric); Packaging: CutTape; PartId: 4816; Part Status: Active; Price: 0.01; Resistance: 51 kOhms; Series: RC_L; Size / Dimension: 0.039" L x 0.020" W (1.00mm x 0.50mm); Supplier 1: DigiKey; Supplier Part Number 1: 311-51KJRCT-ND; Supplier Device Package: 0402; Tolerance: ±5%
R2 R3 = AC0402JR-0722RL: RES SMD 22 OHM 5% 1/16W 0402; Manufacturer: Yageo; Power (Watts): 0.063W, 1/16W; Temperature Coefficient: ±100ppm/°C; Part Number: AC0402JR-0722RL; Value: 22 Ohms; ComponentLink1Description: Datasheet; ComponentLink1URL: https://www.yageo.com/upload/media/product/productsearch/datasheet/rchip/PYu-AC_51_RoHS_L_7.pdf; ComponentLink2Description: DigiKey Link; ComponentLink2URL: https://www.digikey.com/en/products/detail/yageo/AC0402JR-0722RL/5895625; Composition: Thick Film; Device Package: 0402 (1005 Metric); Features: Automotive AEC-Q200, Moisture Resistant; Height - Seated (Max): 0.015" (0.37mm); LastUpdated: 25.07.2024 09:18:12; Lifecycle Status: Active; Minimum Order: 1; Number of Terminations: 2; Operating Temperature: -55°C ~ 155°C; Package / Case: 0402 (1005 Metric); Packaging: CutTape; PartId: 15641; Part Status: Active; Price: 0.01; Ratings: AEC-Q200; Resistance: 22 Ohms; Series: AC; Size / Dimension: 0.039" L x 0.020" W (1.00mm x 0.50mm); Supplier 1: DigiKey; Supplier Part Number 1: YAG3533CT-ND; Supplier Device Package: 0402; Tolerance: ±5%
R4 = RT0402BRE075K1L: RES SMD 5.1K OHM 0.1% 1/16W 0402; Manufacturer: Yageo; Power (Watts): 0.063W, 1/16W; Temperature Coefficient: ±50ppm/°C; Part Number: RT0402BRE075K1L; Value: 5.1 kOhms; ComponentLink1Description: Datasheet; ComponentLink1URL: https://www.yageo.com/upload/media/product/productsearch/datasheet/rchip/PYu-RT_1-to-0.01_RoHS_L_11.pdf; ComponentLink2Description: DigiKey Link; ComponentLink2URL: https://www.digikey.com/en/products/detail/yageo/RT0402BRE075K1L/1069792; Composition: Thin Film; Device Package: 0402 (1005 Metric); Height - Seated (Max): 0.014" (0.35mm); LastUpdated: 25.07.2024 09:18:17; Lifecycle Status: Active; Minimum Order: 1; Number of Terminations: 2; Operating Temperature: -55°C ~ 155°C; Package / Case: 0402 (1005 Metric); Packaging: TapeAndReel; PartId: 4590; Part Status: Active; Price: 0.04; Resistance: 5.1 kOhms; Series: RT; Size / Dimension: 0.039" L x 0.020" W (1.00mm x 0.50mm); Supplier 1: DigiKey; Supplier Part Number 1: YAG4404CT-ND; Supplier Device Package: 0402; Tolerance: ±0.1%
R6 R7 = AT0402BRD071KL: RES SMD 1K OHM 0.1% 1/16W 0402; Manufacturer: Yageo; Power (Watts): 0.063W, 1/16W; Temperature Coefficient: ±25ppm/°C; Part Number: AT0402BRD071KL; Value: 1 kOhms; ComponentLink1Description: Datasheet; ComponentLink1URL: http://www.yageo.com/documents/recent/PYu-AT_51_RoHS_L_5.pdf; ComponentLink2Description: DigiKey Link; ComponentLink2URL: https://www.digikey.com/en/products/detail/yageo/AT0402BRD071KL/5138607; Composition: Thin Film; Device Package: 0402 (1005 Metric); Features: Anti-Sulfur, Automotive AEC-Q200, Moisture Resistant; Height - Seated (Max): 0.014" (0.35mm); LastUpdated: 25.07.2024 09:18:19; Lifecycle Status: Active; Minimum Order: 1; Number of Terminations: 2; Operating Temperature: -55°C ~ 155°C; Package / Case: 0402 (1005 Metric); Packaging: TapeAndReel; PartId: 2462; Part Status: Active; Price: 0.08; Ratings: AEC-Q200; Resistance: 1 kOhms; Series: AT; Size / Dimension: 0.039" L x 0.020" W (1.00mm x 0.50mm); Supplier 1: DigiKey; Supplier Part Number 1: YAG2088CT-ND; Supplier Device Package: 0402; Tolerance: ±0.1%
R8 = RC0402FR-07511KL: RES 511K OHM 1% 1/16W 0402; Manufacturer: Yageo; Power (Watts): 0.063W, 1/16W; Temperature Coefficient: ±100ppm/°C; Part Number: RC0402FR-07511KL; Value: 511 kOhms; ComponentLink1Description: Datasheet; ComponentLink1URL: https://www.yageo.com/upload/media/product/productsearch/datasheet/rchip/PYu-RC_Group_51_RoHS_L_10.pdf; ComponentLink2Description: DigiKey Link; ComponentLink2URL: https://www.digikey.com/en/products/detail/yageo/RC0402FR-07511KL/5281036; Composition: Thick Film; Device Package: 0402 (1005 Metric); Features: Moisture Resistant; Height - Seated (Max): 0.016" (0.40mm); LastUpdated: 25.07.2024 09:18:08; Lifecycle Status: Active; Minimum Order: 1; Number of Terminations: 2; Operating Temperature: -55°C ~ 155°C; Package / Case: 0402 (1005 Metric); Packaging: CutTape; PartId: 20874; Part Status: Active; Price: 0.01; Resistance: 511 kOhms; Series: RC_L; Size / Dimension: 0.039" L x 0.020" W (1.00mm x 0.50mm); Supplier 1: DigiKey; Supplier Part Number 1: YAG3176CT-ND; Supplier Device Package: 0402; Tolerance: ±1%
R9 = RC0201FR-0749K9L: RES 49.9K OHM 1% 1/20W 0201; Manufacturer: Yageo; Power (Watts): 0.05W, 1/20W; Temperature Coefficient: ±200ppm/°C; Part Number: RC0201FR-0749K9L; Value: 49.9 kOhms; ComponentLink1Description: Datasheet; ComponentLink1URL: https://www.yageo.com/upload/media/product/productsearch/datasheet/rchip/PYu-RC_Group_51_RoHS_L_10.pdf; ComponentLink2Description: DigiKey Link; ComponentLink2URL: https://www.digikey.com/en/products/detail/yageo/RC0201FR-0749K9L/5280561; Composition: Thick Film; Device Package: 0201 (0603 Metric); Features: Moisture Resistant; Height - Seated (Max): 0.010" (0.26mm); LastUpdated: 25.07.2024 09:16:26; Lifecycle Status: Active; Minimum Order: 1; Number of Terminations: 2; Operating Temperature: -55°C ~ 125°C; Package / Case: 0201 (0603 Metric); Packaging: TapeAndReel; PartId: 1410; Part Status: Active; Price: 0.01; Resistance: 49.9 kOhms; Series: RC_L; Size / Dimension: 0.024" L x 0.012" W (0.60mm x 0.30mm); Supplier 1: DigiKey; Supplier Part Number 1: YAG2701CT-ND; Supplier Device Package: 0201; Tolerance: ±1%
R10 = RC0402FR-07105KL: RES 105K OHM 1% 1/16W 0402; Manufacturer: Yageo; Power (Watts): 0.063W, 1/16W; Temperature Coefficient: ±100ppm/°C; Part Number: RC0402FR-07105KL; Value: 105 kOhms; ComponentLink1Description: Datasheet; ComponentLink1URL: https://www.yageo.com/upload/media/product/productsearch/datasheet/rchip/PYu-RC_Group_51_RoHS_L_10.pdf; ComponentLink2Description: DigiKey Link; ComponentLink2URL: https://www.digikey.com/en/products/detail/yageo/RC0402FR-07105KL/5280806; Composition: Thick Film; Device Package: 0402 (1005 Metric); Features: Moisture Resistant; Height - Seated (Max): 0.016" (0.40mm); LastUpdated: 25.07.2024 09:18:18; Lifecycle Status: Active; Minimum Order: 1; Number of Terminations: 2; Operating Temperature: -55°C ~ 155°C; Package / Case: 0402 (1005 Metric); Packaging: CutTape; PartId: 2693; Part Status: Active; Price: 0.01; Resistance: 105 kOhms; Series: RC_L; Size / Dimension: 0.039" L x 0.020" W (1.00mm x 0.50mm); Supplier 1: DigiKey; Supplier Part Number 1: YAG2946CT-ND; Supplier Device Package: 0402; Tolerance: ±1%
R11 R12 R15 = RC0402FR-07100KL: RES 100K OHM 1% 1/16W 0402; Manufacturer: Yageo; Power (Watts): 0.063W, 1/16W; Temperature Coefficient: ±100ppm/°C; Part Number: RC0402FR-07100KL; Value: 100 kOhms; ComponentLink1Description: Datasheet; ComponentLink1URL: https://www.yageo.com/upload/media/product/productsearch/datasheet/rchip/PYu-RC_Group_51_RoHS_L_10.pdf; ComponentLink2Description: DigiKey Link; ComponentLink2URL: https://www.digikey.com/en/products/detail/yageo/RC0402FR-07100KL/726526; Composition: Thick Film; Device Package: 0402 (1005 Metric); Features: Moisture Resistant; Height - Seated (Max): 0.016" (0.40mm); LastUpdated: 25.07.2024 09:18:11; Lifecycle Status: Active; Minimum Order: 1; Number of Terminations: 2; Operating Temperature: -55°C ~ 155°C; Package / Case: 0402 (1005 Metric); Packaging: CutTape; PartId: 17595; Part Status: Active; Price: 0.01; Resistance: 100 kOhms; Series: RC_L; Size / Dimension: 0.039" L x 0.020" W (1.00mm x 0.50mm); Supplier 1: DigiKey; Supplier Part Number 1: 311-100KLRCT-ND; Supplier Device Package: 0402; Tolerance: ±1%
R13 = RC0402FR-07200KL: RES 200K OHM 1% 1/16W 0402; Manufacturer: Yageo; Power (Watts): 0.063W, 1/16W; Temperature Coefficient: ±100ppm/°C; Part Number: RC0402FR-07200KL; Value: 200 kOhms; ComponentLink1Description: Datasheet; ComponentLink1URL: https://www.yageo.com/upload/media/product/productsearch/datasheet/rchip/PYu-RC_Group_51_RoHS_L_10.pdf; ComponentLink2Description: DigiKey Link; ComponentLink2URL: https://www.digikey.com/en/products/detail/yageo/RC0402FR-07200KL/726558; Composition: Thick Film; Device Package: 0402 (1005 Metric); Features: Moisture Resistant; Height - Seated (Max): 0.016" (0.40mm); LastUpdated: 25.07.2024 09:18:11; Lifecycle Status: Active; Minimum Order: 1; Number of Terminations: 2; Operating Temperature: -55°C ~ 155°C; Package / Case: 0402 (1005 Metric); Packaging: CutTape; PartId: 17925; Part Status: Active; Price: 0.01; Resistance: 200 kOhms; Series: RC_L; Size / Dimension: 0.039" L x 0.020" W (1.00mm x 0.50mm); Supplier 1: DigiKey; Supplier Part Number 1: 311-200KLRCT-ND; Supplier Device Package: 0402; Tolerance: ±1%
R14 = RC0402FR-0713K3L: RES 13.3K OHM 1% 1/16W 0402; Manufacturer: Yageo; Power (Watts): 0.063W, 1/16W; Temperature Coefficient: ±100ppm/°C; Part Number: RC0402FR-0713K3L; Value: 13.3 kOhms; ComponentLink1Description: Datasheet; ComponentLink1URL: https://www.yageo.com/upload/media/product/productsearch/datasheet/rchip/PYu-RC_Group_51_RoHS_L_10.pdf; ComponentLink2Description: DigiKey Link; ComponentLink2URL: https://www.digikey.com/en/products/detail/yageo/RC0402FR-0713K3L/5280834; Composition: Thick Film; Device Package: 0402 (1005 Metric); Features: Moisture Resistant; Height - Seated (Max): 0.016" (0.40mm); LastUpdated: 25.07.2024 09:18:19; Lifecycle Status: Active; Minimum Order: 1; Number of Terminations: 2; Operating Temperature: -55°C ~ 155°C; Package / Case: 0402 (1005 Metric); Packaging: CutTape; PartId: 2643; Part Status: Active; Price: 0.01; Resistance: 13.3 kOhms; Series: RC_L; Size / Dimension: 0.039" L x 0.020" W (1.00mm x 0.50mm); Supplier 1: DigiKey; Supplier Part Number 1: YAG2974CT-ND; Supplier Device Package: 0402; Tolerance: ±1%
U1 = TPS54302DDCR: Buck Switching Regulator IC Positive Adjustable 0.596V 1 Output 3A SOT-23-6 Thin, TSOT-23-6; Manufacturer: Texas Instrument; Function: Step-Down; Number of Outputs: 1; Voltage - Input (Min): 4.5V; Voltage - Input (Max): 28V; Frequency - Switching: 400kHz; ComponentLink1Description: Datasheet; ComponentLink1URL: https://www.ti.com/lit/ds/symlink/tps54302.pdf; ComponentLink2Description: Digikey Link; ComponentLink2URL: https://www.digikey.com/en/products/detail/texas-instruments/tps54302ddcr/6572466; Topology: Buck; Output Type: Adjustable; Voltage - Output (Min/Fixed): 0.596V; Voltage - Output (Max): 28V; Current-Output: 3A; Operating Temperature: -40°C ~ 125°C (TJ); Supplier Device Package: SOT-23-THIN